# Altium project MK2B.PrjPCB
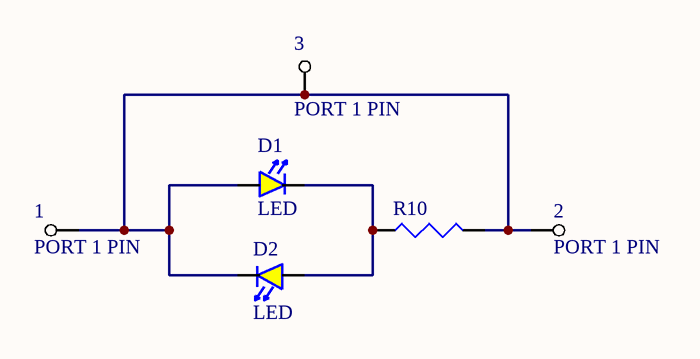
[diagram p0: MK2B.SchDoc]
1 sheet, 6 parts. Net scope: global (net labels, ports and power ports of the same name join across sheets).
Board file: MK2B.PcbDoc

## Sheet MK2B.SchDoc
size A

### Parts
1  PORT 1 PIN  [PIN1 4mm hole 2]
2  PORT 1 PIN  [PIN1 4mm hole 2]
3  PORT 1 PIN  [PIN1 4mm hole 2]
D1  LED  [Res 2012-0805]
D2  LED  [Res 2012-0805]
R10  Res3  [Res 2012-0805]  (value not drawn)

### Nets
Net1_1: 1.1 2.1 3.1 D1.1(A) D2.2(K) R10.2
NetD1_2: D1.2(K) D2.1(A) R10.1

### Library data of the parts
D1 D2 = LED SMD OSRAM 0603: Hyper-Bright Low Current LED OSRAM
R10 = Res3: Resistor; Value: 1K; Published: 8-Jun-2000; Revision: July-2002: Re-released for DXP Platform.; Publisher: Altium Limited